# Altium schematic sheet SDRAM0.SchDoc
size A3; SheetNumber: 3; SheetTotal: 6
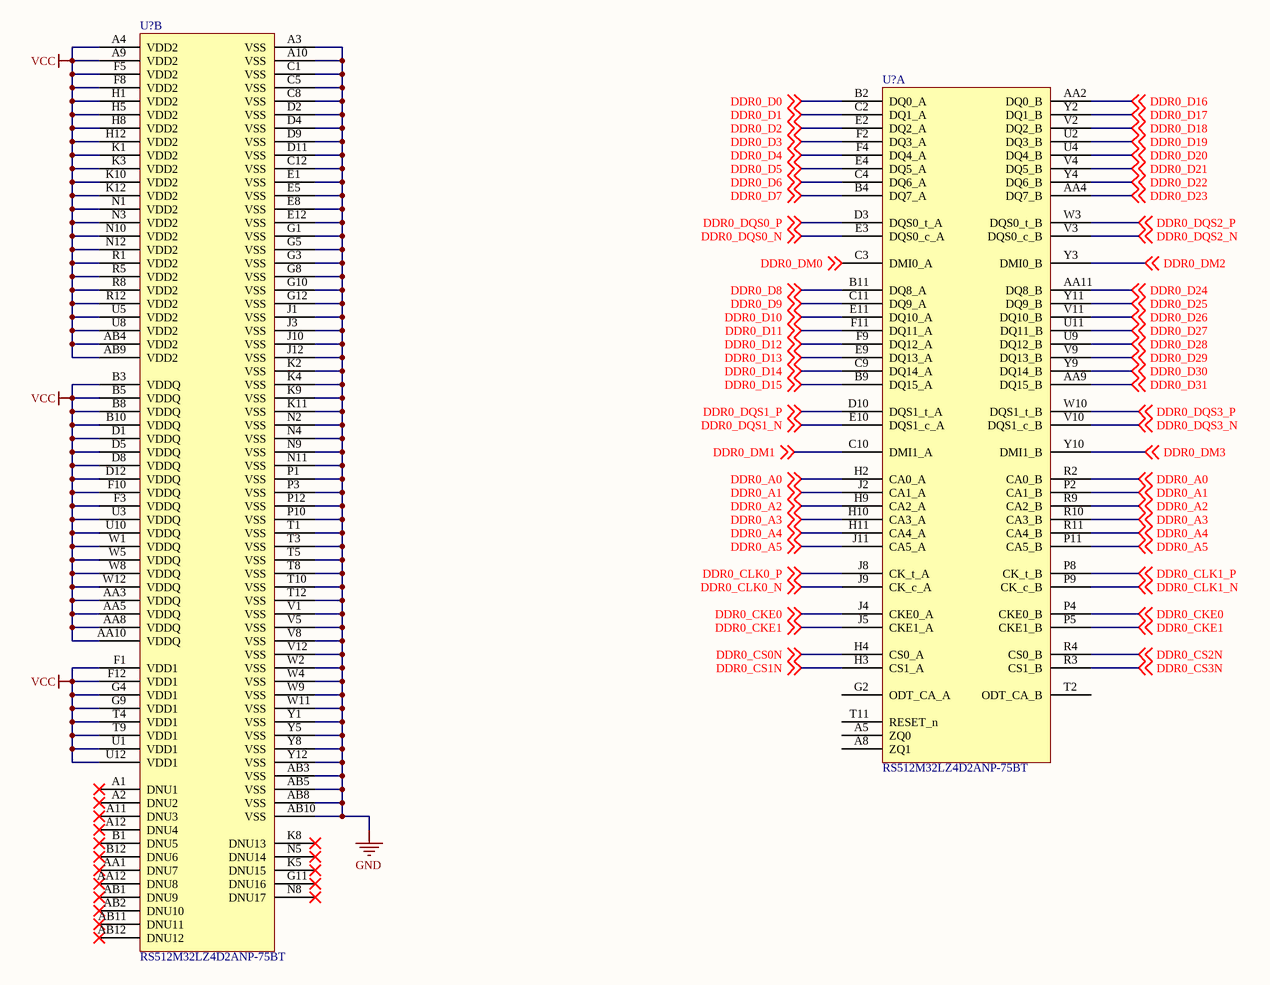
[diagram p0: SDRAM0.SchDoc]

## Parts
(Parts that share a designator on the sheet are numbered #1, #2 ... from top to bottom, then left to right.)
U?#1  RS512M32LZ4D2ANP-75BT  [FBGA200_SMD]  (part B of 2)
U?#2  RS512M32LZ4D2ANP-75BT  [FBGA200_SMD]  (part A of 2)

## Nets
GND: U?#1.A3(VSS) U?#1.A10(VSS) U?#1.AB3(VSS) U?#1.AB5(VSS) U?#1.AB8(VSS) U?#1.AB10(VSS) U?#1.C1(VSS) U?#1.C5(VSS) U?#1.C8(VSS) U?#1.C12(VSS) U?#1.D2(VSS) U?#1.D4(VSS) U?#1.D9(VSS) U?#1.D11(VSS) U?#1.E1(VSS) U?#1.E5(VSS) U?#1.E8(VSS) U?#1.E12(VSS) U?#1.G1(VSS) U?#1.G3(VSS) U?#1.G5(VSS) U?#1.G8(VSS) U?#1.G10(VSS) U?#1.G12(VSS) U?#1.J1(VSS) U?#1.J3(VSS) U?#1.J10(VSS) U?#1.J12(VSS) U?#1.K2(VSS) U?#1.K4(VSS) U?#1.K9(VSS) U?#1.K11(VSS) U?#1.N2(VSS) U?#1.N4(VSS) U?#1.N9(VSS) U?#1.N11(VSS) U?#1.P1(VSS) U?#1.P3(VSS) U?#1.P10(VSS) U?#1.P12(VSS) U?#1.T1(VSS) U?#1.T3(VSS) U?#1.T5(VSS) U?#1.T8(VSS) U?#1.T10(VSS) U?#1.T12(VSS) U?#1.V1(VSS) U?#1.V5(VSS) U?#1.V8(VSS) U?#1.V12(VSS) U?#1.W2(VSS) U?#1.W4(VSS) U?#1.W9(VSS) U?#1.W11(VSS) U?#1.Y1(VSS) U?#1.Y5(VSS) U?#1.Y8(VSS) U?#1.Y12(VSS)
VCC: U?#1.A4(VDD2) U?#1.A9(VDD2) U?#1.AA3(VDDQ) U?#1.AA5(VDDQ) U?#1.AA8(VDDQ) U?#1.AA10(VDDQ) U?#1.AB4(VDD2) U?#1.AB9(VDD2) U?#1.B3(VDDQ) U?#1.B5(VDDQ) U?#1.B8(VDDQ) U?#1.B10(VDDQ) U?#1.D1(VDDQ) U?#1.D5(VDDQ) U?#1.D8(VDDQ) U?#1.D12(VDDQ) U?#1.F1(VDD1) U?#1.F3(VDDQ) U?#1.F5(VDD2) U?#1.F8(VDD2) U?#1.F10(VDDQ) U?#1.F12(VDD1) U?#1.G4(VDD1) U?#1.G9(VDD1) U?#1.H1(VDD2) U?#1.H5(VDD2) U?#1.H8(VDD2) U?#1.H12(VDD2) U?#1.K1(VDD2) U?#1.K3(VDD2) U?#1.K10(VDD2) U?#1.K12(VDD2) U?#1.N1(VDD2) U?#1.N3(VDD2) U?#1.N10(VDD2) U?#1.N12(VDD2) U?#1.R1(VDD2) U?#1.R5(VDD2) U?#1.R8(VDD2) U?#1.R12(VDD2) U?#1.T4(VDD1) U?#1.T9(VDD1) U?#1.U1(VDD1) U?#1.U3(VDDQ) U?#1.U5(VDD2) U?#1.U8(VDD2) U?#1.U10(VDDQ) U?#1.U12(VDD1) U?#1.W1(VDDQ) U?#1.W5(VDDQ) U?#1.W8(VDDQ) U?#1.W12(VDDQ)
DDR0_A0: U?#2.H2(CA0_A) U?#2.R2(CA0_B) ; off-sheet DDR0_A0
DDR0_A1: U?#2.J2(CA1_A) U?#2.P2(CA1_B) ; off-sheet DDR0_A1
DDR0_A2: U?#2.H9(CA2_A) U?#2.R9(CA2_B) ; off-sheet DDR0_A2
DDR0_A3: U?#2.H10(CA3_A) U?#2.R10(CA3_B) ; off-sheet DDR0_A3
DDR0_A4: U?#2.H11(CA4_A) U?#2.R11(CA4_B) ; off-sheet DDR0_A4
DDR0_A5: U?#2.J11(CA5_A) U?#2.P11(CA5_B) ; off-sheet DDR0_A5
DDR0_CKE0: U?#2.J4(CKE0_A) U?#2.P4(CKE0_B) ; off-sheet DDR0_CKE0
DDR0_CKE1: U?#2.J5(CKE1_A) U?#2.P5(CKE1_B) ; off-sheet DDR0_CKE1
DDR0_CLK0_N: U?#2.J9(CK_c_A) ; off-sheet DDR0_CLK0_N
DDR0_CLK0_P: U?#2.J8(CK_t_A) ; off-sheet DDR0_CLK0_P
DDR0_CLK1_N: U?#2.P9(CK_c_B) ; off-sheet DDR0_CLK1_N
DDR0_CLK1_P: U?#2.P8(CK_t_B) ; off-sheet DDR0_CLK1_P
DDR0_CS0N: U?#2.H4(CS0_A) ; off-sheet DDR0_CS0N
DDR0_CS1N: U?#2.H3(CS1_A) ; off-sheet DDR0_CS1N
DDR0_CS2N: U?#2.R4(CS0_B) ; off-sheet DDR0_CS2N
DDR0_CS3N: U?#2.R3(CS1_B) ; off-sheet DDR0_CS3N
DDR0_D0: U?#2.B2(DQ0_A) ; off-sheet DDR0_D0
DDR0_D1: U?#2.C2(DQ1_A) ; off-sheet DDR0_D1
DDR0_D2: U?#2.E2(DQ2_A) ; off-sheet DDR0_D2
DDR0_D3: U?#2.F2(DQ3_A) ; off-sheet DDR0_D3
DDR0_D4: U?#2.F4(DQ4_A) ; off-sheet DDR0_D4
DDR0_D5: U?#2.E4(DQ5_A) ; off-sheet DDR0_D5
DDR0_D6: U?#2.C4(DQ6_A) ; off-sheet DDR0_D6
DDR0_D7: U?#2.B4(DQ7_A) ; off-sheet DDR0_D7
DDR0_D8: U?#2.B11(DQ8_A) ; off-sheet DDR0_D8
DDR0_D9: U?#2.C11(DQ9_A) ; off-sheet DDR0_D9
DDR0_D10: U?#2.E11(DQ10_A) ; off-sheet DDR0_D10
DDR0_D11: U?#2.F11(DQ11_A) ; off-sheet DDR0_D11
DDR0_D12: U?#2.F9(DQ12_A) ; off-sheet DDR0_D12
DDR0_D13: U?#2.E9(DQ13_A) ; off-sheet DDR0_D13
DDR0_D14: U?#2.C9(DQ14_A) ; off-sheet DDR0_D14
DDR0_D15: U?#2.B9(DQ15_A) ; off-sheet DDR0_D15
DDR0_D16: U?#2.AA2(DQ0_B) ; off-sheet DDR0_D16
DDR0_D17: U?#2.Y2(DQ1_B) ; off-sheet DDR0_D17
DDR0_D18: U?#2.V2(DQ2_B) ; off-sheet DDR0_D18
DDR0_D19: U?#2.U2(DQ3_B) ; off-sheet DDR0_D19
DDR0_D20: U?#2.U4(DQ4_B) ; off-sheet DDR0_D20
DDR0_D21: U?#2.V4(DQ5_B) ; off-sheet DDR0_D21
DDR0_D22: U?#2.Y4(DQ6_B) ; off-sheet DDR0_D22
DDR0_D23: U?#2.AA4(DQ7_B) ; off-sheet DDR0_D23
DDR0_D24: U?#2.AA11(DQ8_B) ; off-sheet DDR0_D24
DDR0_D25: U?#2.Y11(DQ9_B) ; off-sheet DDR0_D25
DDR0_D26: U?#2.V11(DQ10_B) ; off-sheet DDR0_D26
DDR0_D27: U?#2.U11(DQ11_B) ; off-sheet DDR0_D27
DDR0_D28: U?#2.U9(DQ12_B) ; off-sheet DDR0_D28
DDR0_D29: U?#2.V9(DQ13_B) ; off-sheet DDR0_D29
DDR0_D30: U?#2.Y9(DQ14_B) ; off-sheet DDR0_D30
DDR0_D31: U?#2.AA9(DQ15_B) ; off-sheet DDR0_D31
DDR0_DM0: U?#2.C3(DMI0_A) ; off-sheet DDR0_DM0
DDR0_DM1: U?#2.C10(DMI1_A) ; off-sheet DDR0_DM1
DDR0_DM2: U?#2.Y3(DMI0_B) ; off-sheet DDR0_DM2
DDR0_DM3: U?#2.Y10(DMI1_B) ; off-sheet DDR0_DM3
DDR0_DQS0_N: U?#2.E3(DQS0_c_A) ; off-sheet DDR0_DQS0_N
DDR0_DQS0_P: U?#2.D3(DQS0_t_A) ; off-sheet DDR0_DQS0_P
DDR0_DQS1_N: U?#2.E10(DQS1_c_A) ; off-sheet DDR0_DQS1_N
DDR0_DQS1_P: U?#2.D10(DQS1_t_A) ; off-sheet DDR0_DQS1_P
DDR0_DQS2_N: U?#2.V3(DQS0_c_B) ; off-sheet DDR0_DQS2_N
DDR0_DQS2_P: U?#2.W3(DQS0_t_B) ; off-sheet DDR0_DQS2_P
DDR0_DQS3_N: U?#2.V10(DQS1_c_B) ; off-sheet DDR0_DQS3_N
DDR0_DQS3_P: U?#2.W10(DQS1_t_B) ; off-sheet DDR0_DQS3_P

Not connected (* = marked no-connect by the designer): U?#1 A1(DNU1)* A2(DNU2)* A11(DNU3)* A12(DNU4)* AA1(DNU7)* AA12(DNU8)* AB1(DNU9)* AB2(DNU10)* AB11(DNU11)* AB12(DNU12)* B1(DNU5)* B12(DNU6)* G11(DNU16)* K5(DNU15)* K8(DNU13)* N5(DNU14)* N8(DNU17)*; U?#2 A5(ZQ0) A8(ZQ1) G2(ODT_CA_A) T2(ODT_CA_B) T11(RESET_n)

## Library data of the parts
U?#1 U?#2 = IC_RS512M32LZ4D2ANP-75BT: LPDDR4/4X Package FBGA 200b Density 4Gbit~64Gbit Operating Temperature Range：-25~85℃ Speed：2667Mbps/3200Mbps/3733Mbps Voltage：VDD1/VDD2/VDDQ= 1.8 / 1.1 / 1.1 V（LPDDR4）VDD1/VDD2/VDDQ = 1.8 / 1.1 / 0.6 V（LPDDR4X）Approved Verification Platform：MTK、Spreadtrum; Manufacturer: RAYSON; Manufacturer Part Number: RS512M32LZ4D2ANP-75BT; Case/Package: FBGA 200b; Supplier-1: RAYSON